# EAGLE design Battery Board rev.2 (EAGLE 9.1.3)
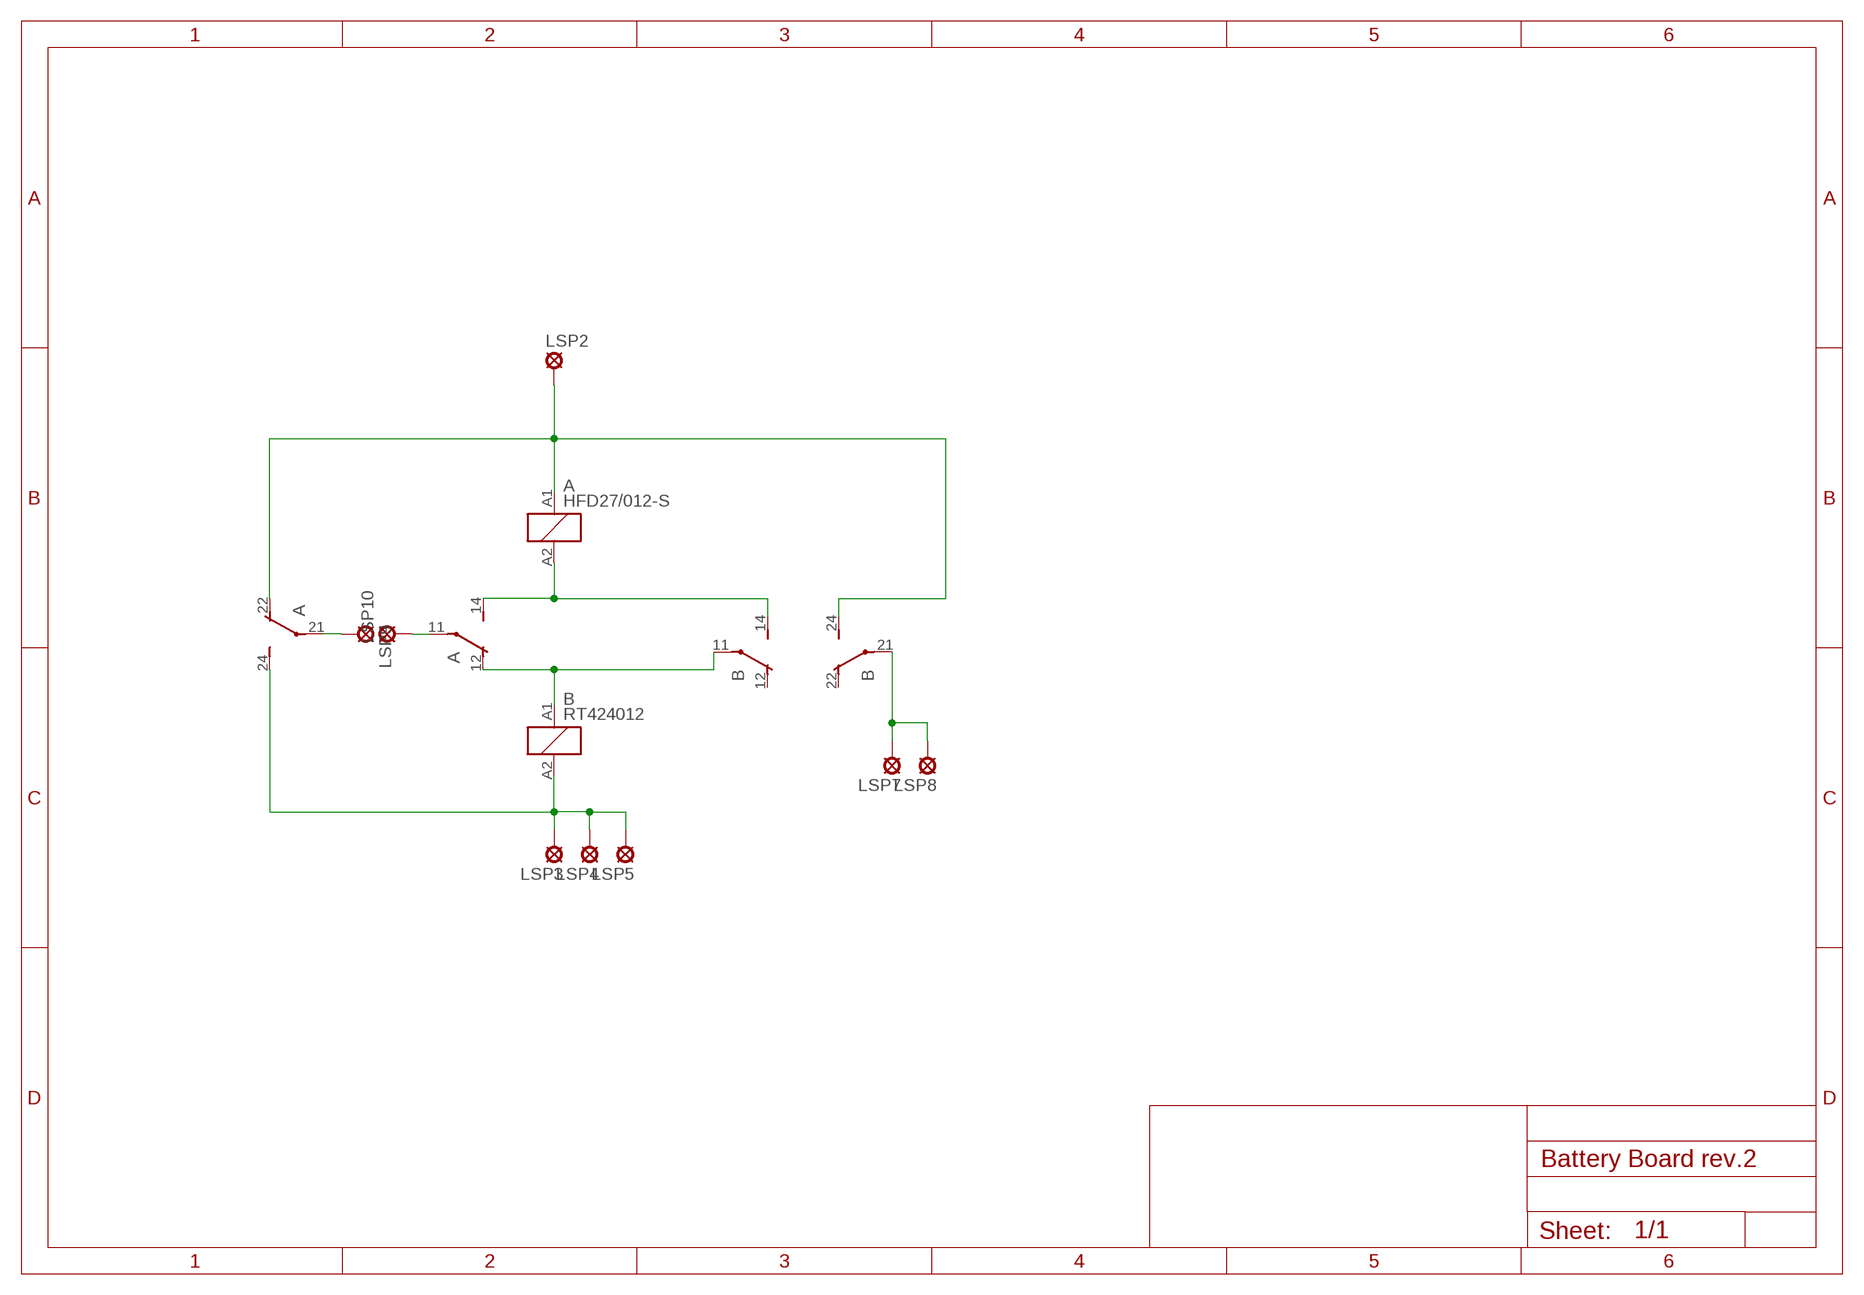
[diagram p0: schematic, sheet 1]

## Parts
A  HFD27/012-S  [JRC27F]
B  RT424012  [RT2C/O]
LSP2  MCS08  [MCS08]
LSP3  MCS08  [MCS08]
LSP4  MCS08  [MCS08]
LSP5  MCS08  [MCS08]
LSP7  MCS08  [MCS08]
LSP8  MCS08  [MCS08]
LSP9  MCS08  [MCS08]
LSP10  MCS08  [MCS08]

## Nets
BATT+: A.22(NC) A.A1 B.24(3:S) LSP2.MP
BATT-: A.24(NO) B.A2 LSP3.MP LSP4.MP LSP5.MP
LOAD_+: B.21(3:P) LSP7.MP LSP8.MP
N$1: A.21(C) LSP9.MP
N$2: A.14(NO) A.A2 B.14(2:S)
N$3: A.12(NC) B.11(2:P) B.A1
N$4: A.11(C) LSP10.MP
Unconnected: B.12(2:O) B.22(3:O)

## Library data of the parts
A = Synergiczne:HFD27
B = relay:RT42?*: Power PCB Relay SCHRACK 2 pole 8 A, DC and AC-coil Source: http://www.schrack.com/.. 5842.pdf; MPN: RT424012; OC_FARNELL: 1629053; OC_NEWARK: 03P2426
LSP2-LSP5 LSP7-LSP10 = solpad:MCS08: SOLDER PAD MC S0,8, drill 1.2 mm, distributor Buerklin, 08F130

## Board
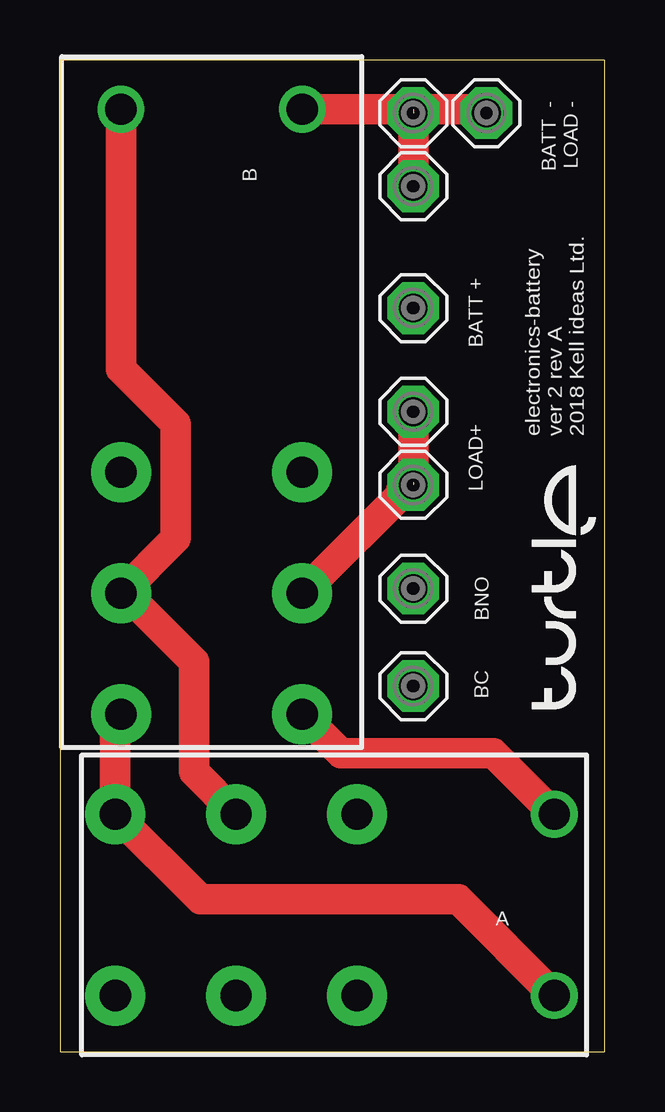
[diagram p1: board, top side]
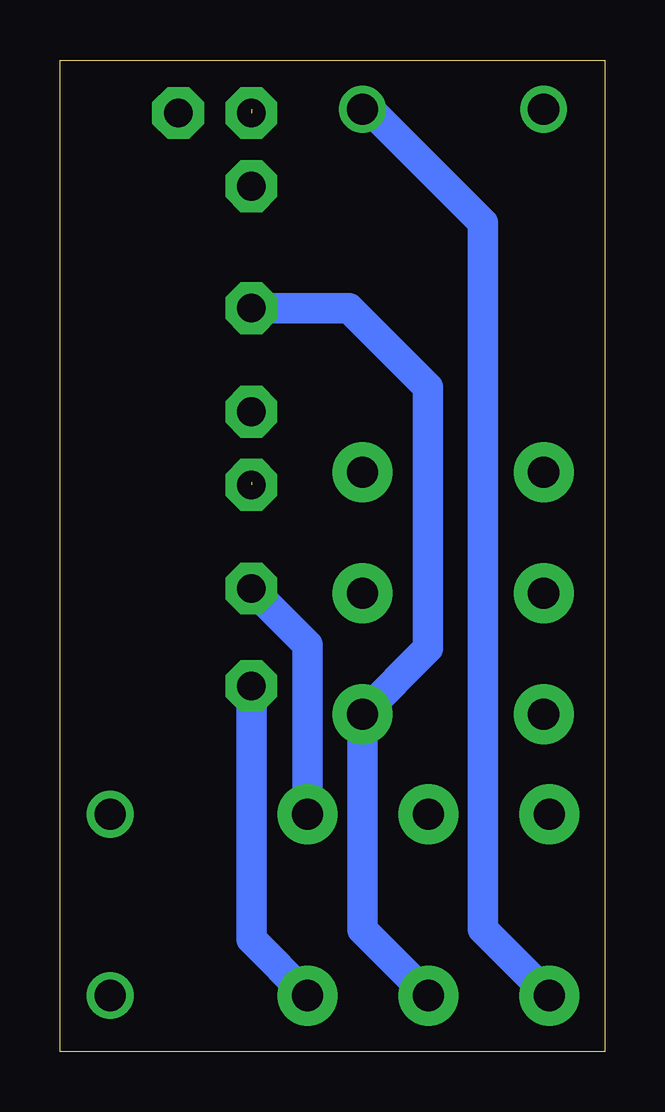
[diagram p2: board, bottom side, seen from below]

Size 22.71 x 41.33 mm. Coordinates in mm from the lower left corner, seen from the top.
Outline: 0,0 22.71,0 22.71,41.33 0,41.33 0,0
Copper layers (1*16): Top 0.035mm / dielectric 1.5mm / Bottom 0.035mm
Design rules "default": minimum track width 6mil, minimum drill 0.35mm, track to track 6mil, track to pad 6mil, pad to pad 6mil, via to via 6mil, smd to smd 6mil, copper to edge 40mil, drill to drill 6mil, minimum pad ring 10mil, minimum via ring 8mil, stop-mask expansion 4mil, vias tented up to drill 0mil, thermal gap 10mil

### Footprints (pad centres in the part's own frame; a part is rotated, then mirrored left to right if it is on the bottom)
JRC27F = drill 1.3 pad 2.5: 11 1.25,-3.68; 12 6.29,-3.68; 14 11.33,-3.68; 21 1.25,3.88; 22 6.29,3.88; 24 11.33,3.88 | drill 1.3: A1 -6.98,-3.68; A2 -6.98,3.88
RT2C/O = drill 1.3 pad 2.5: 11 7.56,-3.68; 12 2.52,-3.68; 14 12.6,-3.68; 21 7.56,3.88; 22 2.52,3.88; 24 12.6,3.88 | drill 1.3: A1 -12.6,-3.68; A2 -12.6,3.88
MCS08 = drill 1.194 pad 2.159 octagon: MP 0,0

### Placement (x,y rotation side)
A  13.64,6.22 180 top
B  6.22,26.67 270 top
LSP2  14.73,30.99 0 top
LSP3  14.73,39.12 0 top
LSP4  14.73,36.07 0 top
LSP5  17.78,39.12 0 top
LSP7  14.73,26.67 0 top
LSP8  14.73,23.62 0 top
LSP9  14.73,15.24 90 top
LSP10  14.73,19.3 90 top

### Tracks (layer width: path | path; a pad name or v marks a point on that pad's centre or on a via)
BATT+
  Top 1.27: B.24 11.73,12.45 18.08,12.45 A.A1
  Bottom 1.27: A.22 10.1,5.1 B.24 7.37,16.81 7.37,27.69 10.67,30.99 LSP2.MP
BATT-  (1 unrouted)
  Top 1.27: LSP5.MP 17.63,39.27 14.73,39.27 | 14.73,39.27 B.A2 | LSP4.MP 14.73,39.27
  Bottom 1.27: A.24 5.08,5.11 5.08,34.54 9.81,39.27 B.A2
LOAD_+  (1 unrouted)
  Top 1.27: 13.6,22.61 B.21 14.73,23.74 14.73,23.88 | LSP7.MP 14.73,23.88 | 14.73,23.88 14.22,23.37
N$1
  Bottom 1.27: A.21 14.73,4.68 LSP9.MP
N$2
  Top 1.27: A.A2 16.61,6.35 5.86,6.35 A.14 2.31,13.84 B.14
N$3
  Top 1.27: B.A1 2.54,28.45 4.83,26.16 4.83,21.39 B.11 2.73,19.11 5.59,16.26 5.59,11.66 A.12
N$4
  Bottom 1.27: A.11 12.39,16.96 LSP10.MP

### Text on the board
tPlace: electronics-battery / ver 2 rev A / 2018 Kell ideas Ltd. | BC
tNames: BATT - / LOAD - | BATT + | LOAD+ | BNO